# EAGLE schematic lamloei_unofox_sfm10r4 (EAGLE 7.7.0)
CNAME: lamloei.com/unofox_sfm10r4; CREVISION: R1; DESIGNER: LAMLOEI
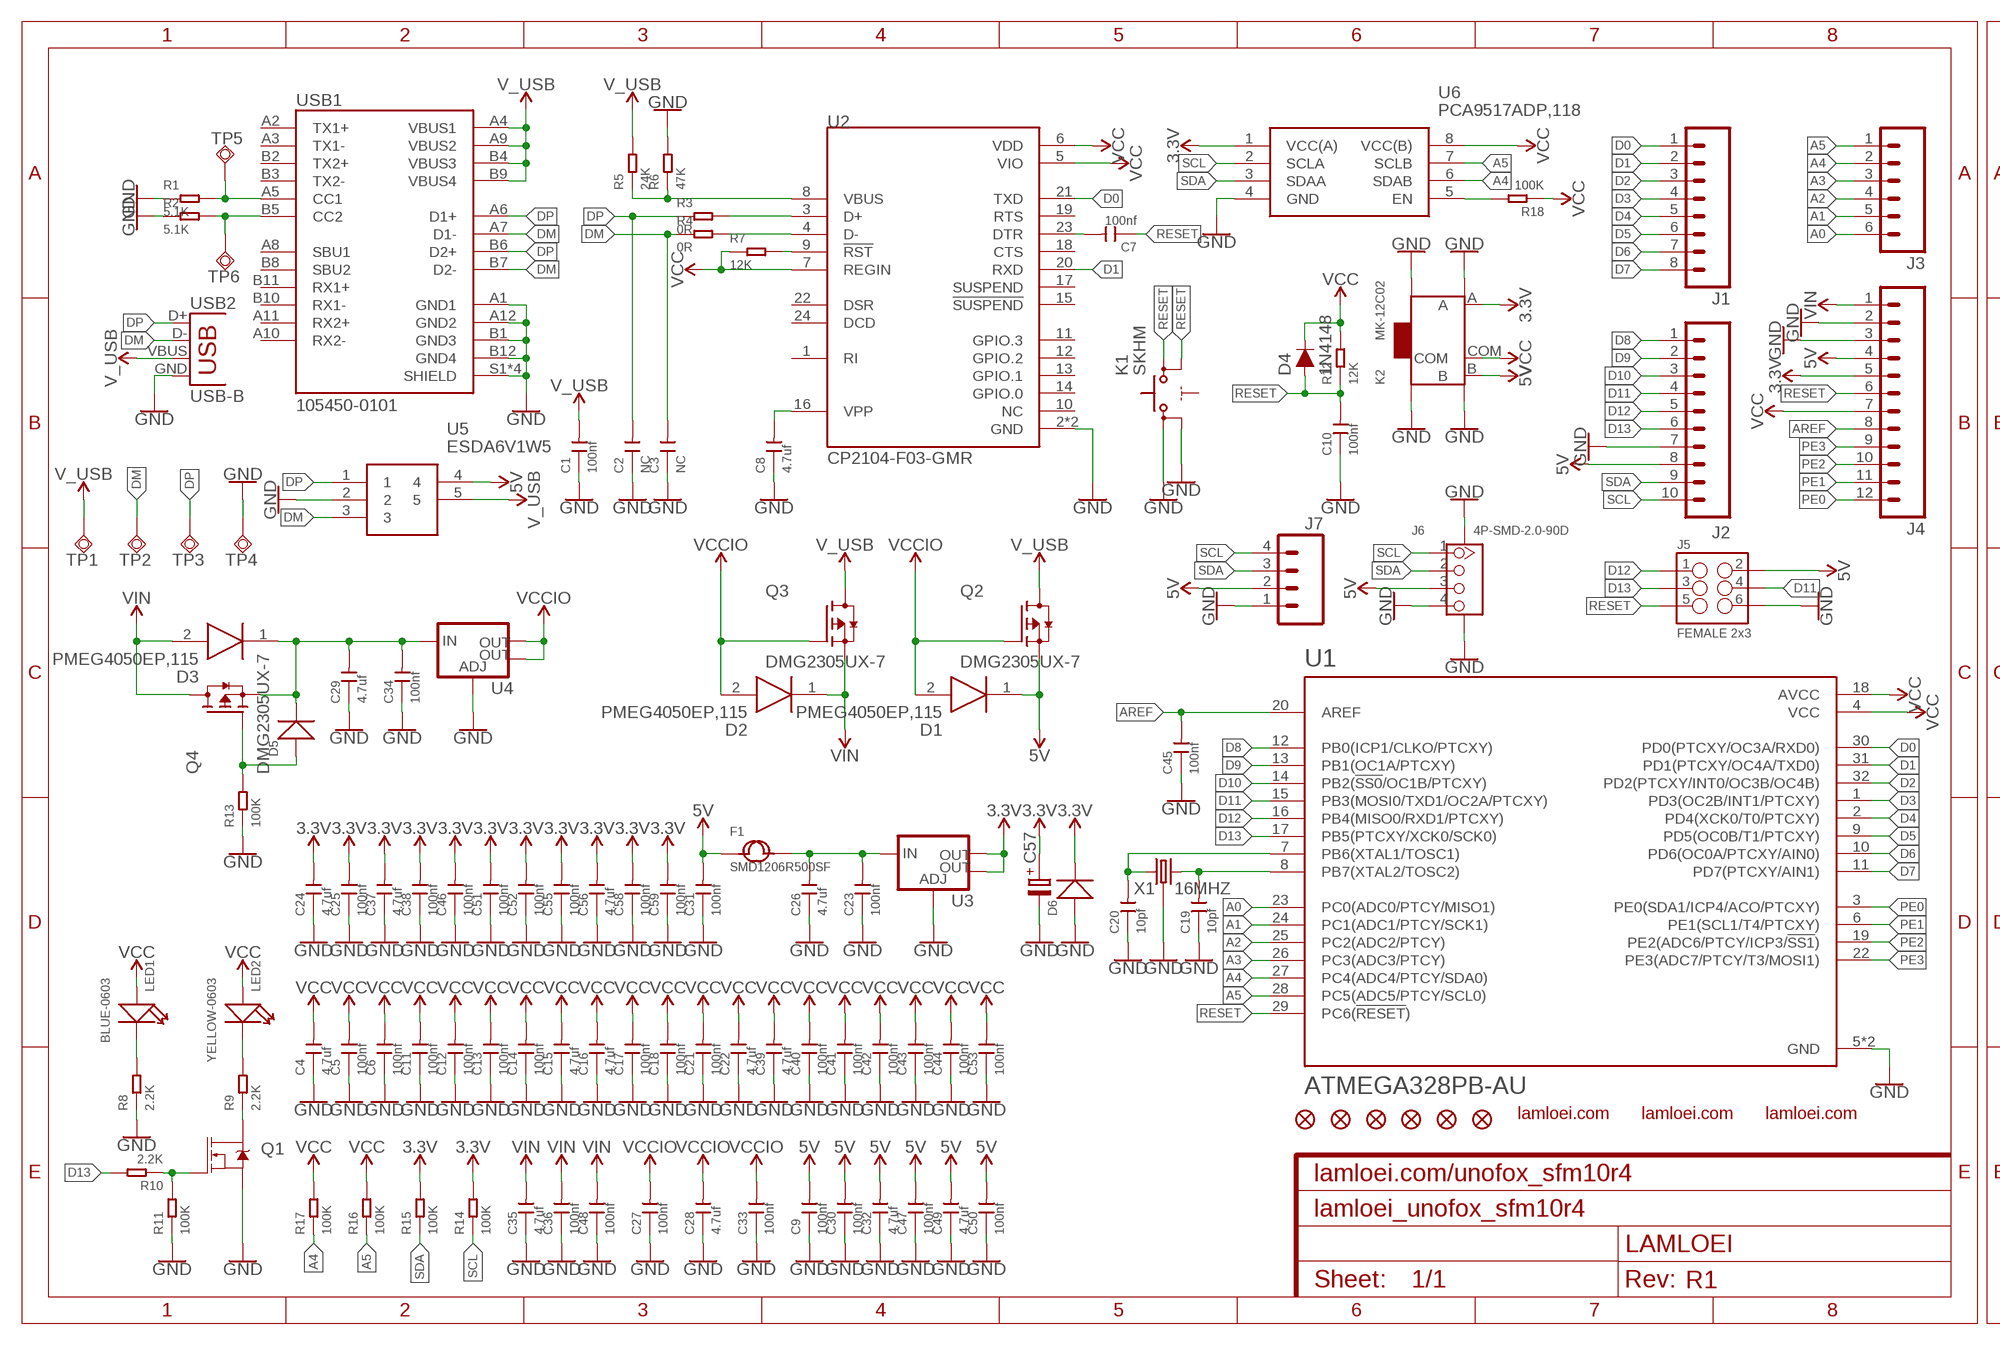
[diagram p0: schematic, sheet 1, part 1 of 2]
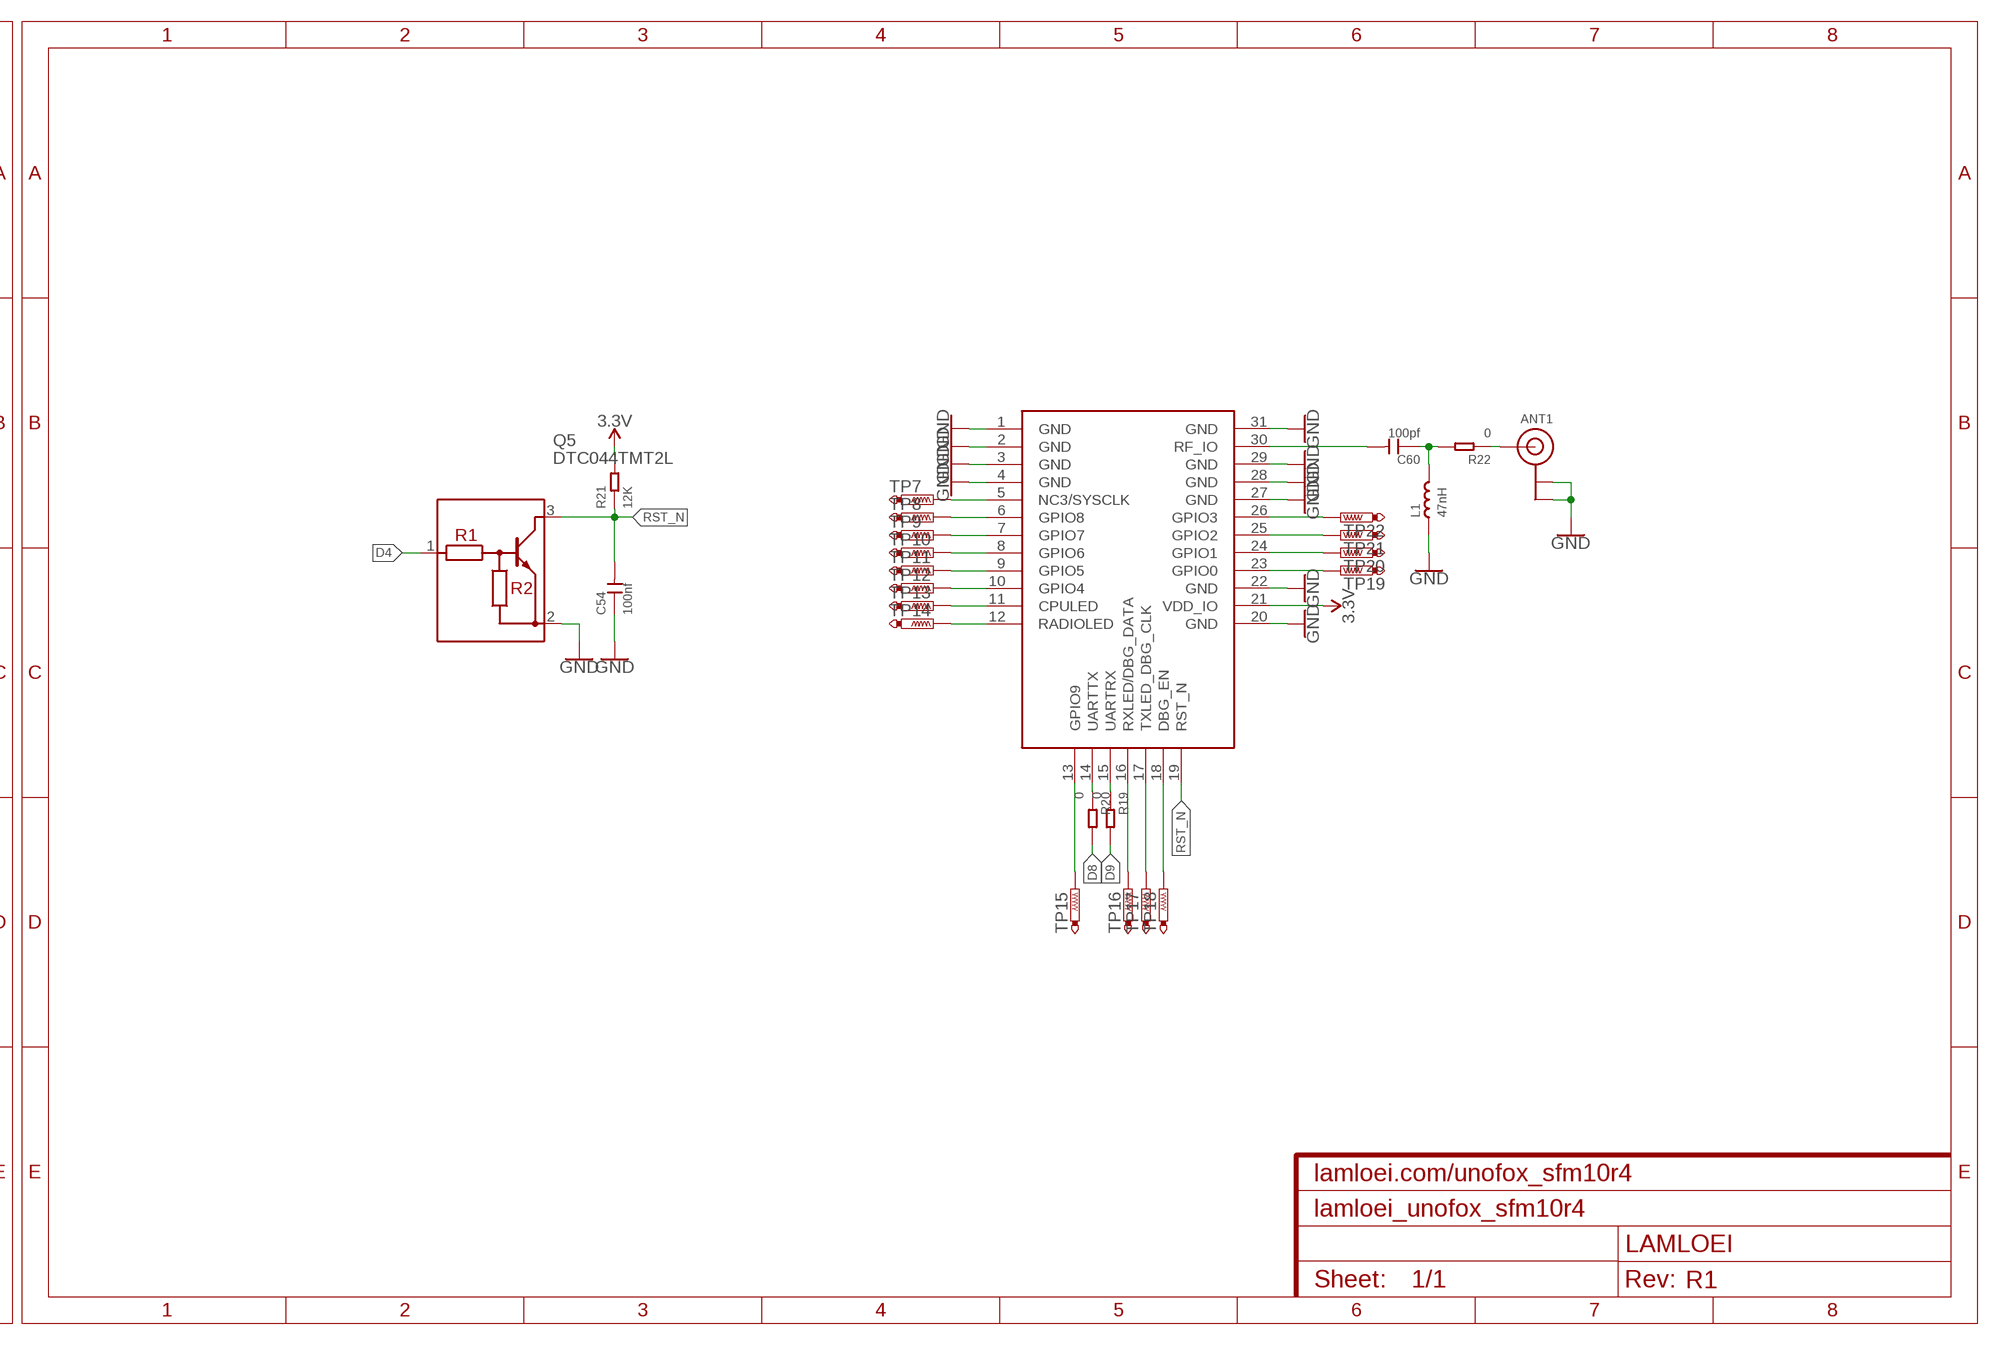
[diagram p1: schematic, sheet 1, part 2 of 2]

## Parts
ANT1  ANTENNA_U.FL  [U.FL]
C1  100nf  CERAMIC-100NF-25V-10%-X7R(0402)  [C0402]
C2  NC  CERAMIC-47PF-50V-5%-NP0(0402)  [C0402]
C3  NC  CERAMIC-47PF-50V-5%-NP0(0402)  [C0402]
C4  4.7uf  CERAMIC-10UF-25V-10%-X5R(0805)  [C0805]
C5  100nf  CERAMIC-100NF-25V-10%-X7R(0402)  [C0402]
C6  100nf  CERAMIC-100NF-25V-10%-X7R(0402)  [C0402]
C7  100nf  CERAMIC-100NF-25V-10%-X7R(0402)  [C0402]
C8  4.7uf  CERAMIC-10UF-25V-10%-X5R(0805)  [C0805]
C9  100nf  CERAMIC-100NF-25V-10%-X7R(0402)  [C0402]
C10  100nf  CERAMIC-100NF-25V-10%-X7R(0402)  [C0402]
C11  100nf  CERAMIC-100NF-25V-10%-X7R(0402)  [C0402]
C12  100nf  CERAMIC-100NF-25V-10%-X7R(0402)  [C0402]
C13  100nf  CERAMIC-100NF-25V-10%-X7R(0402)  [C0402]
C14  100nf  CERAMIC-100NF-25V-10%-X7R(0402)  [C0402]
C15  4.7uf  CERAMIC-10UF-25V-10%-X5R(0805)  [C0805]
C16  4.7uf  CERAMIC-10UF-25V-10%-X5R(0805)  [C0805]
C17  100nf  CERAMIC-100NF-25V-10%-X7R(0402)  [C0402]
C18  100nf  CERAMIC-100NF-25V-10%-X7R(0402)  [C0402]
C19  10pf  CERAMIC-100NF-25V-10%-X7R(0402)  [C0402]
C20  10pf  CERAMIC-100NF-25V-10%-X7R(0402)  [C0402]
C21  100nf  CERAMIC-100NF-25V-10%-X7R(0402)  [C0402]
C22  4.7uf  CERAMIC-10UF-25V-10%-X5R(0805)  [C0805]
C23  100nf  CERAMIC-100NF-25V-10%-X7R(0402)  [C0402]
C24  4.7uf  CERAMIC-10UF-25V-10%-X5R(0805)  [C0805]
C25  100nf  CERAMIC-100NF-25V-10%-X7R(0402)  [C0402]
C26  4.7uf  CERAMIC-10UF-25V-10%-X5R(0805)  [C0805]
C27  100nf  CERAMIC-100NF-25V-10%-X7R(0402)  [C0402]
C28  4.7uf  CERAMIC-10UF-25V-10%-X5R(0805)  [C0805]
C29  4.7uf  CERAMIC-10UF-25V-10%-X5R(0805)  [C0805]
C30  100nf  CERAMIC-100NF-25V-10%-X7R(0402)  [C0402]
C31  100nf  CERAMIC-100NF-25V-10%-X7R(0402)  [C0402]
C32  4.7uf  CERAMIC-10UF-25V-10%-X5R(0805)  [C0805]
C33  100nf  CERAMIC-100NF-25V-10%-X7R(0402)  [C0402]
C34  100nf  CERAMIC-100NF-25V-10%-X7R(0402)  [C0402]
C35  4.7uf  CERAMIC-10UF-25V-10%-X5R(0805)  [C0805]
C36  100nf  CERAMIC-100NF-25V-10%-X7R(0402)  [C0402]
C37  4.7uf  CERAMIC-10UF-25V-10%-X5R(0805)  [C0805]
C38  100nf  CERAMIC-100NF-25V-10%-X7R(0402)  [C0402]
C39  4.7uf  CERAMIC-10UF-25V-10%-X5R(0805)  [C0805]
C40  100nf  CERAMIC-100NF-25V-10%-X7R(0402)  [C0402]
C41  100nf  CERAMIC-100NF-25V-10%-X7R(0402)  [C0402]
C42  100nf  CERAMIC-100NF-25V-10%-X7R(0402)  [C0402]
C43  100nf  CERAMIC-100NF-25V-10%-X7R(0402)  [C0402]
C44  100nf  CERAMIC-100NF-25V-10%-X7R(0402)  [C0402]
C45  100nf  CERAMIC-100NF-25V-10%-X7R(0402)  [C0402]
C46  100nf  CERAMIC-100NF-25V-10%-X7R(0402)  [C0402]
C47  100nf  CERAMIC-100NF-25V-10%-X7R(0402)  [C0402]
C48  100nf  CERAMIC-100NF-25V-10%-X7R(0402)  [C0402]
C49  4.7uf  CERAMIC-10UF-25V-10%-X5R(0805)  [C0805]
C50  100nf  CERAMIC-100NF-25V-10%-X7R(0402)  [C0402]
C51  100nf  CERAMIC-100NF-25V-10%-X7R(0402)  [C0402]
C52  100nf  CERAMIC-100NF-25V-10%-X7R(0402)  [C0402]
C53  100nf  CERAMIC-100NF-25V-10%-X7R(0402)  [C0402]
C54  100nf  CERAMIC-100NF-25V-10%-X7R(0402)  [C0402]
C55  100nf  CERAMIC-100NF-25V-10%-X7R(0402)  [C0402]
C56  4.7uf  CERAMIC-10UF-25V-10%-X5R(0805)  [C0805]
C57  C-PR-SMD-TE-D  [TE-D-7343]
C58  100nf  CERAMIC-100NF-25V-10%-X7R(0402)  [C0402]
C59  100nf  CERAMIC-100NF-25V-10%-X7R(0402)  [C0402]
C60  100pf  CERAMIC-100NF-25V-10%-X7R(0402)  [C0402]
D1  PMEG4050EP,115  [SODFL4725X110N]
D2  PMEG4050EP,115  [SODFL4725X110N]
D3  PMEG4050EP,115  [SODFL4725X110N]
D4  1N4148  DIODE-BAS16J  [SOD-323]
D5  DIODE'1N4148-SMD'  [LL-34]
D6  DIODE'1N4148-SMD'  [LL-34]
F1  SMD1206R500SF  SMD-PPTC-500MA(1206)  [F1206]
J1  M08SILK_FEMALE_PTH  [1X08]
J2  M10SILK_FEMALE_PTH  [1X10]
J3  M06SILK_FEMALE_PTH  [1X06]
J4  M12PTH  [1X12]
J5  FEMALE 2x3  M03X2FEMALE  [2X3]
J6  4P-SMD-2.0-90D  GROVE-CONNECTOR-SMD-90D(4+2P-2.0)  [HW4-SMD-2.0-90D]
J7  M04LONGPADS  [1X04_LONGPADS]
K1  SKHM  [SKHM]
K2  MK-12C02  SMD-TOGGLE-SWITCH-ON-ON(3+4P-6.7X2.7MM)  [SW7-SMD-L6.7X2.7X3.2MM]
L1  47nH  SMD-INDUCTOR-68NH-10%(0603)  [L0603]
LED1  BLUE-0603  SMD-LED-CLEAR-BLUE(0603)  [LED-0603]
LED2  YELLOW-0603  SMD-LED-CLEAR-BLUE(0603)  [LED-0603]
Q1  220mA/50V/3.5Ω  MOSFET-NCH-BSS138  [SOT23-3]
Q2  DMG2305UX-7  [SOT91P240X110-3N_DMG2305UX-7]
Q3  DMG2305UX-7  [SOT91P240X110-3N_DMG2305UX-7]
Q4  DMG2305UX-7  [SOT91P240X110-3N_DMG2305UX-7]
Q5  DTC044TMT2L  [SOTFL40P120X55-3N]
R1  5.1K  SMD-RES-4.7K-5%-1/16W(0402)  [R0402]
R2  5.1K  SMD-RES-4.7K-5%-1/16W(0402)  [R0402]
R3  0R  SMD-RES-22R-1%-1/16W(0402)  [R0402]
R4  0R  SMD-RES-22R-1%-1/16W(0402)  [R0402]
R5  24K  SMD-RES-22R-1%-1/16W(0402)  [R0402]
R6  47K  SMD-RES-22R-1%-1/16W(0402)  [R0402]
R7  12K  SMD-RES-10K-1%-1/16W(0402)  [R0402]
R8  2.2K  SMD-RES-2.7K-1%-1/16W(0402)  [R0402]
R9  2.2K  SMD-RES-2.7K-1%-1/16W(0402)  [R0402]
R10  2.2K  SMD-RES-2.7K-1%-1/16W(0402)  [R0402]
R11  100K  SMD-RES-10K-1%-1/16W(0402)  [R0402]
R12  12K  SMD-RES-10K-1%-1/16W(0402)  [R0402]
R13  100K  SMD-RES-10K-1%-1/16W(0402)  [R0402]
R14  100K  SMD-RES-10K-1%-1/16W(0402)  [R0402]
R15  100K  SMD-RES-10K-1%-1/16W(0402)  [R0402]
R16  100K  SMD-RES-10K-1%-1/16W(0402)  [R0402]
R17  100K  SMD-RES-10K-1%-1/16W(0402)  [R0402]
R18  100K  SMD-RES-10K-1%-1/16W(0402)  [R0402]
R19  0  SMD-RES-10K-1%-1/16W(0402)  [R0402]
R20  0  SMD-RES-10K-1%-1/16W(0402)  [R0402]
R21  12K  SMD-RES-10K-1%-1/16W(0402)  [R0402]
R22  0  SMD-RES-10K-1%-1/16W(0402)  [R0402]
TP1  TPSQTP13SQ  [TP13SQ]
TP2  TPSQTP13SQ  [TP13SQ]
TP3  TPSQTP13SQ  [TP13SQ]
TP4  TPSQTP13SQ  [TP13SQ]
TP5  TPSQTP13SQ  [TP13SQ]
TP6  TPSQTP13SQ  [TP13SQ]
TP7  PTR1B1,27  [B1,27]
TP8  PTR1B1,27  [B1,27]
TP9  PTR1B1,27  [B1,27]
TP10  PTR1B1,27  [B1,27]
TP11  PTR1B1,27  [B1,27]
TP12  PTR1B1,27  [B1,27]
TP13  PTR1B1,27  [B1,27]
TP14  PTR1B1,27  [B1,27]
TP15  PTR1B1,27  [B1,27]
TP16  PTR1B1,27  [B1,27]
TP17  PTR1B1,27  [B1,27]
TP18  PTR1B1,27  [B1,27]
TP19  PTR1B1,27  [B1,27]
TP20  PTR1B1,27  [B1,27]
TP21  PTR1B1,27  [B1,27]
TP22  PTR1B1,27  [B1,27]
U1  ATMEGA328PB-AU  [QFP80P900X900X120-32N]
U2  CP2104-F03-GMR  [CP2104-F03-GMR]
U3  V_REG_LM1117SOT223  [SOT223]
U4  V_REG_LM1117SOT223  [SOT223]
U5  ESDA6V1W5  [SOT65P210X110-5N]
U6  PCA9517ADP,118  [SOP65P490X110-8N]
U7  WSSFM10RWSSFM10R2R4  [WSSFM10R]
USB1  105450-0101  [105450-0101]
USB2  USB-B  USBPTH  [USB-B-PTH]
X1  16MHZ  CRYSTAL-26MHZSMD-3.2X2.5  [CRYSTAL-SMD-3.2X2.5MM]
ZFC1  FIDUCIAL1X2  [FIDUCIAL-1X2]
ZFC2  FIDUCIAL1X2  [FIDUCIAL-1X2]
ZFC3  FIDUCIAL1X2  [FIDUCIAL-1X2]
ZFD1  FIDUCIAL1X2  [FIDUCIAL-1X2]
ZFD2  FIDUCIAL1X2  [FIDUCIAL-1X2]
ZFD3  FIDUCIAL1X2  [FIDUCIAL-1X2]
ZL1  LAMLEOI_LOGO_3  [LAMLEOI_LOGO_3]
ZL2  LAMLEOI_LOGO_3  [LAMLEOI_LOGO_3]
ZL3  LAMLOEI_BIGLOGO  [LAMLOEI_BIGLOGO]

## Nets
3.3V: C24.2 C25.2 C37.2 C38.2 C46.2 C51.2 C52.2 C55.2 C56.2 C57.+ C58.2 C59.2 D6.C(-) J4.5 K2.A R14.2 R15.2 R21.2 U3.2(OUT) U3.4(OUT) U6.1(VCC(A)) U7.21(VDD_IO)
5V: C9.2 C30.2 C31.2 C32.2 C47.2 C49.2 C50.2 D1.1(K) F1.1 J2.8 J4.4 J5.2 J6.3 J7.2 K2.B Q2.2(S) U5.4
A0: J3.6 U1.23(PC0(ADC0/PTCY/MISO1))
A1: J3.5 U1.24(PC1(ADC1/PTCY/SCK1))
A2: J3.4 U1.25(PC2(ADC2/PTCY))
A3: J3.3 U1.26(PC3(ADC3/PTCY))
A4: J3.2 R17.1 U1.27(PC4(ADC4/PTCY/SDA0)) U6.6(SDAB)
A5: J3.1 R16.1 U1.28(PC5(ADC5/PTCY/SCL0)) U6.7(SCLB)
AREF: C45.2 J4.8 U1.20(AREF)
D0: J1.1 U1.30(PD0(PTCXY/OC3A/RXD0)) U2.21(TXD)
D1: J1.2 U1.31(PD1(PTCXY/OC4A/TXD0)) U2.20(RXD)
D2: J1.3 U1.32(PD2(PTCXY/INT0/OC3B/OC4B))
D3: J1.4 U1.1(PD3(OC2B/INT1/PTCXY))
D4: J1.5 Q5.1(B) U1.2(PD4(XCK0/T0/PTCXY))
D5: J1.6 U1.9(PD5(OC0B/T1/PTCXY))
D6: J1.7 U1.10(PD6(OC0A/PTCXY/AIN0))
D7: J1.8 U1.11(PD7(PTCXY/AIN1))
D8: J2.1 R20.2 U1.12(PB0(ICP1/CLKO/PTCXY))
D9: J2.2 R19.2 U1.13(PB1(OC1A/PTCXY))
D10: J2.3 U1.14(PB2(!SS0!/OC1B/PTCXY))
D11: J2.4 J5.4 U1.15(PB3(MOSI0/TXD1/OC2A/PTCXY))
D12: J2.5 J5.1 U1.16(PB4(MISO0/RXD1/PTCXY))
D13: J2.6 J5.3 R10.2 U1.17(PB5(PTCXY/XCK0/SCK0))
DM: C3.2 R4.1 TP2.TP U5.3 USB1.A7(D1-) USB1.B7(D2-) USB2.D-
DP: C2.2 R3.1 TP3.TP U5.1 USB1.A6(D1+) USB1.B6(D2+) USB2.D+
GND [gnd]: ANT1.1(GND) ANT1.2(GND) C1.1 C2.1 C3.1 C4.1 C5.1 C6.1 C8.1 C9.1 C10.1 C11.1 C12.1 C13.1 C14.1 C15.1 C16.1 C17.1 C18.1 C19.1 C20.1 C21.1 C22.1 C23.1 C24.1 C25.1 C26.1 C27.1 C28.1 C29.1 C30.1 C31.1 C32.1 C33.1 C34.1 C35.1 C36.1 C37.1 C38.1 C39.1 C40.1 C41.1 C42.1 C43.1 C44.1 C45.1 C46.1 C47.1 C48.1 C49.1 C50.1 C51.1 C52.1 C53.1 C54.1 C55.1 C56.1 C57.- C58.1 C59.1 D6.A(+) J2.7 J4.2 J4.3 J5.6 J6.4 J6.SS1 J6.SS2 J7.1 K1.1 K1.2 K2.SS1 K2.SS2 K2.SS3 K2.SS4 L1.1 Q1.2(S) Q5.2(E) R1.1 R2.1 R6.2 R8.1 R11.1 R13.1 TP4.TP U1.5(GND) U1.21(GND) U2.2(GND) U2.25(GND) U3.1(ADJ) U4.1(ADJ) U5.2 U6.4(GND) U7.1(GND) U7.2(GND) U7.3(GND) U7.4(GND) U7.20(GND) U7.22(GND) U7.27(GND) U7.28(GND) U7.29(GND) U7.31(GND) USB1.A1(GND1) USB1.A12(GND2) USB1.B1(GND3) USB1.B12(GND4) USB1.S1(SHIELD) USB1.S2(SHIELD) USB1.S3(SHIELD) USB1.S4(SHIELD) USB2.GND X1.2 X1.4
N$3: R2.2 TP6.TP USB1.B5(CC2)
N$4: R1.2 TP5.TP USB1.A5(CC1)
N$6: R3.2 U2.3(D+)
N$7: R4.2 U2.4(D-)
N$8: R5.1 R6.1 U2.8(VBUS)
N$9: C23.2 C26.2 F1.2 U3.3(IN)
N$10: LED1.- R8.2
N$11: C20.2 U1.7(PB6(XTAL1/TOSC1)) X1.1
N$12: C7.2 U2.23(DTR)
N$13: C29.2 C34.2 D3.1(K) D5.C(-) Q4.2(S) U4.3(IN)
N$14: R7.2 U2.9(!RST)
N$15: LED2.- R9.2
N$16: C8.2 U2.16(VPP)
N$17: C60.2 U7.30(RF_IO)
N$18: C19.2 U1.8(PB7(XTAL2/TOSC2)) X1.3
N$19: R18.2 U6.5(EN)
N$20: C60.1 L1.2 R22.2
N$21: Q1.1(G) R10.1 R11.2
N$22: Q1.3(D) R9.1
N$23: ANT1.3(SIGNAL) R22.1
N$24: R20.1 U7.14(UARTTX)
N$25: R19.1 U7.15(UARTRX)
N$26: D5.A(+) Q4.1(G) R13.2
N$27: TP7.TP U7.5(NC3/SYSCLK)
N$28: TP8.TP U7.6(GPIO8)
N$29: TP9.TP U7.7(GPIO7)
N$30: TP10.TP U7.8(GPIO6)
N$31: TP11.TP U7.9(GPIO5)
N$32: TP12.TP U7.10(GPIO4)
N$33: TP13.TP U7.11(CPULED)
N$34: TP14.TP U7.12(RADIOLED)
N$35: TP22.TP U7.26(GPIO3)
N$36: TP21.TP U7.25(GPIO2)
N$37: TP20.TP U7.24(GPIO1)
N$38: TP19.TP U7.23(GPIO0)
N$39: TP15.TP U7.13(GPIO9)
N$40: TP18.TP U7.18(DBG_EN)
N$41: TP17.TP U7.17(TXLED_DBG_CLK)
N$42: TP16.TP U7.16(RXLED/DBG_DATA)
PE0: J4.12 U1.3(PE0(SDA1/ICP4/ACO/PTCXY))
PE1: J4.11 U1.6(PE1(SCL1/T4/PTCXY))
PE2: J4.10 U1.19(PE2(ADC6/PTCY/ICP3/!SS1!))
PE3: J4.9 U1.22(PE3(ADC7/PTCY/T3/MOSI1))
RESET: C7.1 C10.2 D4.A J4.6 J5.5 K1.3(S1) K1.4(S2) R12.1 U1.29(PC6(!RESET!))
RST_N: C54.2 Q5.3(C) R21.1 U7.19(RST_N)
SCL: J2.10 J6.1 J7.4 R14.1 U6.2(SCLA)
SDA: J2.9 J6.2 J7.3 R15.1 U6.3(SDAA)
V_USB: C1.2 Q2.3(D) Q3.3(D) R5.2 TP1.TP U5.5 USB1.A4(VBUS1) USB1.A9(VBUS2) USB1.B4(VBUS3) USB1.B9(VBUS4) USB2.VBUS
VCC: C4.2 C5.2 C6.2 C11.2 C12.2 C13.2 C14.2 C15.2 C16.2 C17.2 C18.2 C21.2 C22.2 C39.2 C40.2 C41.2 C42.2 C43.2 C44.2 C53.2 D4.C J4.7 K2.COM LED1.+ LED2.+ R7.1 R12.2 R16.2 R17.2 R18.1 U1.4(VCC) U1.18(AVCC) U2.5(VIO) U2.6(VDD) U2.7(REGIN) U6.8(VCC(B))
VCCIO: C27.2 C28.2 C33.2 D1.2(A) D2.2(A) Q2.1(G) Q3.1(G) U4.2(OUT) U4.4(OUT)
VIN: C35.2 C36.2 C48.2 D2.1(K) D3.2(A) J4.1 Q3.2(S) Q4.3(D)
Unconnected: K1.5(G) U2.1(RI) U2.10(NC) U2.11(GPIO.3) U2.12(GPIO.2) U2.13(GPIO.1) U2.14(GPIO.0) U2.15(!SUSPEND) U2.17(SUSPEND) U2.18(CTS) U2.19(RTS) U2.22(DSR) U2.24(DCD) USB1.A2(TX1+) USB1.A3(TX1-) USB1.A8(SBU1) USB1.A10(RX2-) USB1.A11(RX2+) USB1.B2(TX2+) USB1.B3(TX2-) USB1.B8(SBU2) USB1.B10(RX1-) USB1.B11(RX1+)

## Library data of the parts
ANT1 = adafruit:ANTENNA_U.FL: U.FL Antenna Connector
C1 C5-C7 C9-C14 C17 C18 C21 C23 C25 C27 C30 C31 C33 C34 C36 C38 C40-C48 C50-C55 C58 C59 = Capacitor-2016:CERAMIC-100NF-25V-10%-X7R(0402): 302010024; MPN: CC0402KRX7R8BB104
C2 C3 = Capacitor-2016:CERAMIC-47PF-50V-5%-NP0(0402): 302010007; MPN: CC0402JRNPO9BN470; VALUE: 47PF
C4 C8 C15 C16 C22 C24 C26 C28 C29 C32 C35 C37 C39 C49 C56 = Capacitor-2016:CERAMIC-10UF-25V-10%-X5R(0805): 302010178; MPN: CC0805KKX5R8BB106; VALUE: 10uf
C19 C20 C60 = Capacitor-2016:CERAMIC-100NF-25V-10%-X7R(0402): 302010024; MPN: CC0402KRX7R8BB104; VALUE: 100nf
C57 = cap-pan40:C-PR: POLARIZED ELECTROLYTIC/TANTALUM
D1-D3 = lamloei-PMEG4050EP_115:PMEG4050EP,115: Nexperia PMEG4050EP,115 SMT Schottky Diode, 40V 5A, 2-Pin SOD-128 Source: Datasheet <http://uk.rs-online.com/web/p/products/7805405P>; DESCRIPTION: Nexperia PMEG4050EP,115 SMT Schottky Diode, 40V 5A, 2-Pin SOD-128; HEIGHT: 1.1mm; MANUFACTURER_NAME: Nexperia; MANUFACTURER_PART_NUMBER: PMEG4050EP,115; RS_PART_NUMBER: 7805405P; RS_PRICE-STOCK: http://uk.rs-online.com/web/p/products/7805405P
D4 = SparkFun-DiscreteSemi:DIODE: Diode These are standard reverse protection diodes and small signal diodes. SparkFun Products: SparkFun SparkPunk Sound Kit <https://www.sparkfun.com/products/11177> SparkFun ESP8266 Thing <https://www.sparkfun.com/products/13231>; PROD_ID: DIO-09646; VALUE: 250mA/100V
D5 D6 = Seeed-OPL-Diode:DIODE*
F1 = Fuse-2016:SMD-PPTC-500MA(1206): 307010002; MPN: SMD1206R500SF
J1 = SparkFun-Connectors2:M08: Header 8 Standard 8-pin 0.1" header. Use with straight break away headers (SKU : PRT-00116), right angle break away headers (PRT-00553), swiss pins (PRT-00743), machine pins (PRT-00117), and female headers (PRT-00115).; PROD_ID: CONN-08438
J2 = SparkFun-Connectors2:M10: Header 10 Standard 10-pin 0.1" header. Use with straight break away headers (SKU : PRT-00116), right angle break away headers (PRT-00553), swiss pins (PRT-00743), machine pins (PRT-00117), and female headers (PRT-00115).; PROD_ID: CONN-11563
J3 = SparkFun-Connectors2:M06: Header 6 Standard 6-pin 0.1" header. Use with straight break away headers (SKU : PRT-00116), right angle break away headers (PRT-00553), swiss pins (PRT-00743), machine pins (PRT-00117), and female headers (PRT-00115). Molex polarized connector foot print use with SKU : PRT-08094 with associated crimp pins and housings. NOTES ON THE VARIANTS LOCK and LOCK_LONGPADS... This footprint was designed to help hold the alignment of a through-hole component (i.e. 6-pin header) while soldering it into place. You may notice that each hole has been shifted either up or down by 0.005 of an inch from it's more standard position (which is a perfectly straight line). This slight alteration caused the pins (the squares in the middle) to touch the edges of the holes. Because they are alternating, it causes a "brace" to hold the component in place. 0.005 has proven to be the perfect amount of "off-center" position when using our standard breakaway headers. Although looks a little odd when you look at the bare footprint, once you have a header in there, the alteration is very hard to notice. Also,if you push a header all the way into place, it is covered up entirely on the bottom side. This idea of altering the position of holes to aid alignment will be further integrated into the Sparkfun Library for other footprints. It can help hold any component with 3 or more connection pins.; PROD_ID: CONN-08437
J4 = SparkFun-Connectors2:M12: Header 12 Standard 12-pin 0.1" header. Use with straight break away headers (SKU : PRT-00116), right angle break away headers (PRT-00553), swiss pins (PRT-00743), machine pins (PRT-00117), and female headers (PRT-00115).
J5 = SparkFun-Connectors:M03X2: 2x3 .1" header. Shrouded, with keying- CONN-10681 SMT- CONN-11415 Pogo pins- HW-11044; PROD_ID: CONN-11566
J6 = Seeed-OPL-Connector:GROVE-CONNECTOR-SMD-90D(4+2P-2.0): 320110032
J7 = SparkFun-Connectors:M04: Header 4 Standard 4-pin 0.1" header. Use with straight break away headers (SKU : PRT-00116), right angle break away headers (PRT-00553), swiss pins (PRT-00743), machine pins (PRT-00117), and female headers (PRT-00115). Molex polarized connector foot print use with SKU : PRT-08231 with associated crimp pins and housings. 1MM SMD Version SKU: PRT-10208; PROD_ID: CONN-09696
K1 = switch-alps:SKHM: TACT SWITCH
K2 = Seeed-OPL-Button4:SMD-TOGGLE-SWITCH-ON-ON(3+4P-6.7X2.7MM): 311030001
L1 = Seeed-OPL-Inductor:SMD-INDUCTOR-68NH-10%(0603): 303010062; VALUE: 68NH
LED1 = Seeed-OPL-Diode:SMD-LED-CLEAR-BLUE(0603): 304090045; MPN: 19-217-BHC-ZL1M2RY-3T
LED2 = Seeed-OPL-Diode:SMD-LED-CLEAR-BLUE(0603): 304090045; MPN: 19-217-BHC-ZL1M2RY-3T; VALUE: BLUE-0603
Q1 = SparkFun-DiscreteSemi:MOSFET-NCH: N-channel MOSFETs Voltage controlled devices that allow control of high current outputs. SparkFun Products: SparkFun OpenScale <https://www.sparkfun.com/products/13261> SparkFun Digital Sandbox <https://www.sparkfun.com/products/12651> SparkFun Monster Moto Shield <https://www.sparkfun.com/products/10182> SparkFun MOSFET Power Controller <https://www.sparkfun.com/products/11214>; PROD_ID: TRANS-00830
Q2-Q4 = lamloei-DMG2305UX-7:DMG2305UX-7: DMG2305UX Series 20 V 65 Ohms P-Ch Enhancement Mode Mosfet - SOT-23-3; AVAILABILITY: Unavailable; DESCRIPTION: P-Channel 20V 4.2A _Ta_ 1.4W _Ta_ Surface Mount SOT-23; MF: Diodes Inc.; MP: DMG2305UX-7; PACKAGE: SOT-23-3 Diodes Inc.; PRICE: None
Q5 = lamloei-DTC044TMT2L:DTC044TMT2L: ROHM, DTC044TMT2L NPN Resistor-equipped Transistor, 60 mA 50 V Ratio Of 47 k, 3-Pin SOT-723 Source: Datasheet <http://uk.rs-online.com/web/p/products/1467267>; DESCRIPTION: ROHM, DTC044TMT2L NPN Resistor-equipped Transistor, 60 mA 50 V Ratio Of 47 k, 3-Pin SOT-723; HEIGHT: 0.55mm; MANUFACTURER_NAME: ROHM Semiconductor; MANUFACTURER_PART_NUMBER: DTC044TMT2L; RS_PART_NUMBER: 1467267; RS_PRICE-STOCK: http://uk.rs-online.com/web/p/products/1467267
R1 R2 = Resistor-2016:SMD-RES-4.7K-5%-1/16W(0402): 301010010; MPN: RC0402JR-074K7L; VALUE: 4.7K
R3-R6 = Resistor-2016:SMD-RES-22R-1%-1/16W(0402): 301010052; MPN: RC0402FR-0722RL; VALUE: 22R
R7 R11-R22 = Resistor-2016:SMD-RES-10K-1%-1/16W(0402): 301010047; MPN: RC0402FR-0710KL; VALUE: 10K 1/16W
R8-R10 = Resistor-2016:SMD-RES-2.7K-1%-1/16W(0402): 301010671; MPN: RC0402FR-072K7L; VALUE: 2.7K 1/16W
TP1-TP6 = testpad:TPSQ: Test pad
TP7-TP22 = testpad:PTR1: TEST PIN
U1 = lamloei-ATMEGA328PB-AU:ATMEGA328PB-AU: ATmega Series 20 MHz 32 KB Flash 2 KB SRAM 8-Bit Microcontroller - TQFP-32; AVAILABILITY: Unavailable; DESCRIPTION: AVR AVR® ATmega Microcontroller IC 8-Bit 20MHz 32KB _16K x 16_ FLASH 32-TQFP _7x7_; MF: Microchip Technology; MP: ATMEGA328PB-AU; PACKAGE: TQFP-32 Microchip Technology; PRICE: None
U2 = lamloei-CP2104-F03-GMR:CP2104-F03-GMR: USB-to-UART 1-CH 576byte FIFO 3.3V 24-Pin QFN EP T/R; BE: Basic Part; DESCRIPTION: USB 1/1 2MBPS 3V ~ 3.6V QFN-24_4X4X05P ROHS; LCSC_PART: C47742; MF: Silicon Labs; MP: CP2104-F03-GMR; PACKAGE: QFN-24_EP_4.0x4.0x0.5P; PRICE: $1.2119; PRICE_DATE: 201912
U3 U4 = SparkFun-PowerIC-2:V_REG_LM1117: Voltage Regulator LM1117 Standard adjustable voltage regulator but in SMD form. Spark Fun Electronics SKU : COM-00595; PROD_ID: VREG-08170
U5 = ESDA6V1W5:ESDA6V1W5: TVS Diode Array Uni-Directional ESDA6V1W5 Quad, 150W, SOT-323 5-Pin Source: Datasheet <http://uk.rs-online.com/web/p/products/1685770>; ALLIED_NUMBER: 70389948; DESCRIPTION: TVS Diode Array Uni-Directional ESDA6V1W5 Quad, 150W, SOT-323 5-Pin; HEIGHT: 1.1mm; MANUFACTURER_NAME: STMicroelectronics; MANUFACTURER_PART_NUMBER: ESDA6V1W5; RS_PART_NUMBER: 1685770
U6 = lamloei-PCA9517ADP_118:PCA9517ADP,118: PCA9517ADP,118, Bus Repeater I2C, 8-Pin TSSOP Source: Datasheet <http://uk.rs-online.com/web/p/products/7258745P>; DESCRIPTION: PCA9517ADP,118, Bus Repeater I2C, 8-Pin TSSOP; HEIGHT: 1.1mm; MANUFACTURER_NAME: Nexperia; MANUFACTURER_PART_NUMBER: PCA9517ADP,118; RS_PART_NUMBER: 7258745P; RS_PRICE-STOCK: http://uk.rs-online.com/web/p/products/7258745P
U7 = lamloei-WSSFM10R:WSSFM10R
USB1 = lamloei-105450-0101:105450-0101: USB Shielded I/O Receptacle; Type C; Right Angle; Surface Mount; Gold over Nickel; AVAILABILITY: Unavailable; DESCRIPTION: USB Shielded I/O Receptacle; Type C; Right Angle; Surface Mount; Gold over Nickel; MF: Molex; MP: 105450-0101; PACKAGE: None; PRICE: None
USB2 = SparkFun-Connectors-Bighole:USB: USB Connectors USB-B-PTH is fully proven SKU : PRT-00139/CONN-08278 USB-miniB is fully proven SKU : PRT-00587 USB-A-PCB is untested. USB-A-H is throughly reviewed, but untested. Spark Fun Electronics SKU : PRT-00437 USB-B-SMT is throughly reviewed, but untested. Needs silkscreen touching up. USB-A-S has not been used/tested USB-MB-H has not been used/tested USB-MICROB has been used. CONN-09505; PROD_ID: CONN-08278
X1 = SparkFun-Clocks:CRYSTAL-26MHZ: 26MHz Crystal w/ Ground Pin Digikey Example <http://www.digikey.com/product-detail/en/epson/TSX-3225%2026.0000MF09Z-AC3/SER3627CT-ND/1802878> Frequency: 26MHz Frequency Stability: ±9ppm Frequency Tolerance: ±10ppm Load Capacitance: 9pF SparkFun Products: SparkFun ESP32 Thing <https://www.sparkfun.com/products/13907> SparkFun ESP8266 Thing Dev Board <https://www.sparkfun.com/products/13711>; PROD_ID: XTAL-12454
ZFC1-ZFC3 ZFD1-ZFD3 = SparkFun-Aesthetics:FIDUCIAL: Fiducial Alignment Points Point-of-reference for pick-and-place machines and other optical instruments.
ZL1 ZL2 = lamloei_logo_3:LAMLEOI_LOGO_3: lamloei
ZL3 = lamloei_logo_3:LAMLOEI_BIGLOGO

## Net classes
0 default: width 0.254 mm, clearance 0.152 mm
1 power: width 0.61 mm, drill 0.61 mm, clearance 0.152 mm
2 gnd: width 0.305 mm, drill 0.483 mm, clearance 0.152 mm
3 usbvcc: width 0.508 mm, drill 0.61 mm, clearance 0.152 mm
4 aref: width 0.406 mm, drill 0.61 mm, clearance 0.152 mm